# EAGLE schematic RedBot Mechanical Bumper (EAGLE 6.4)
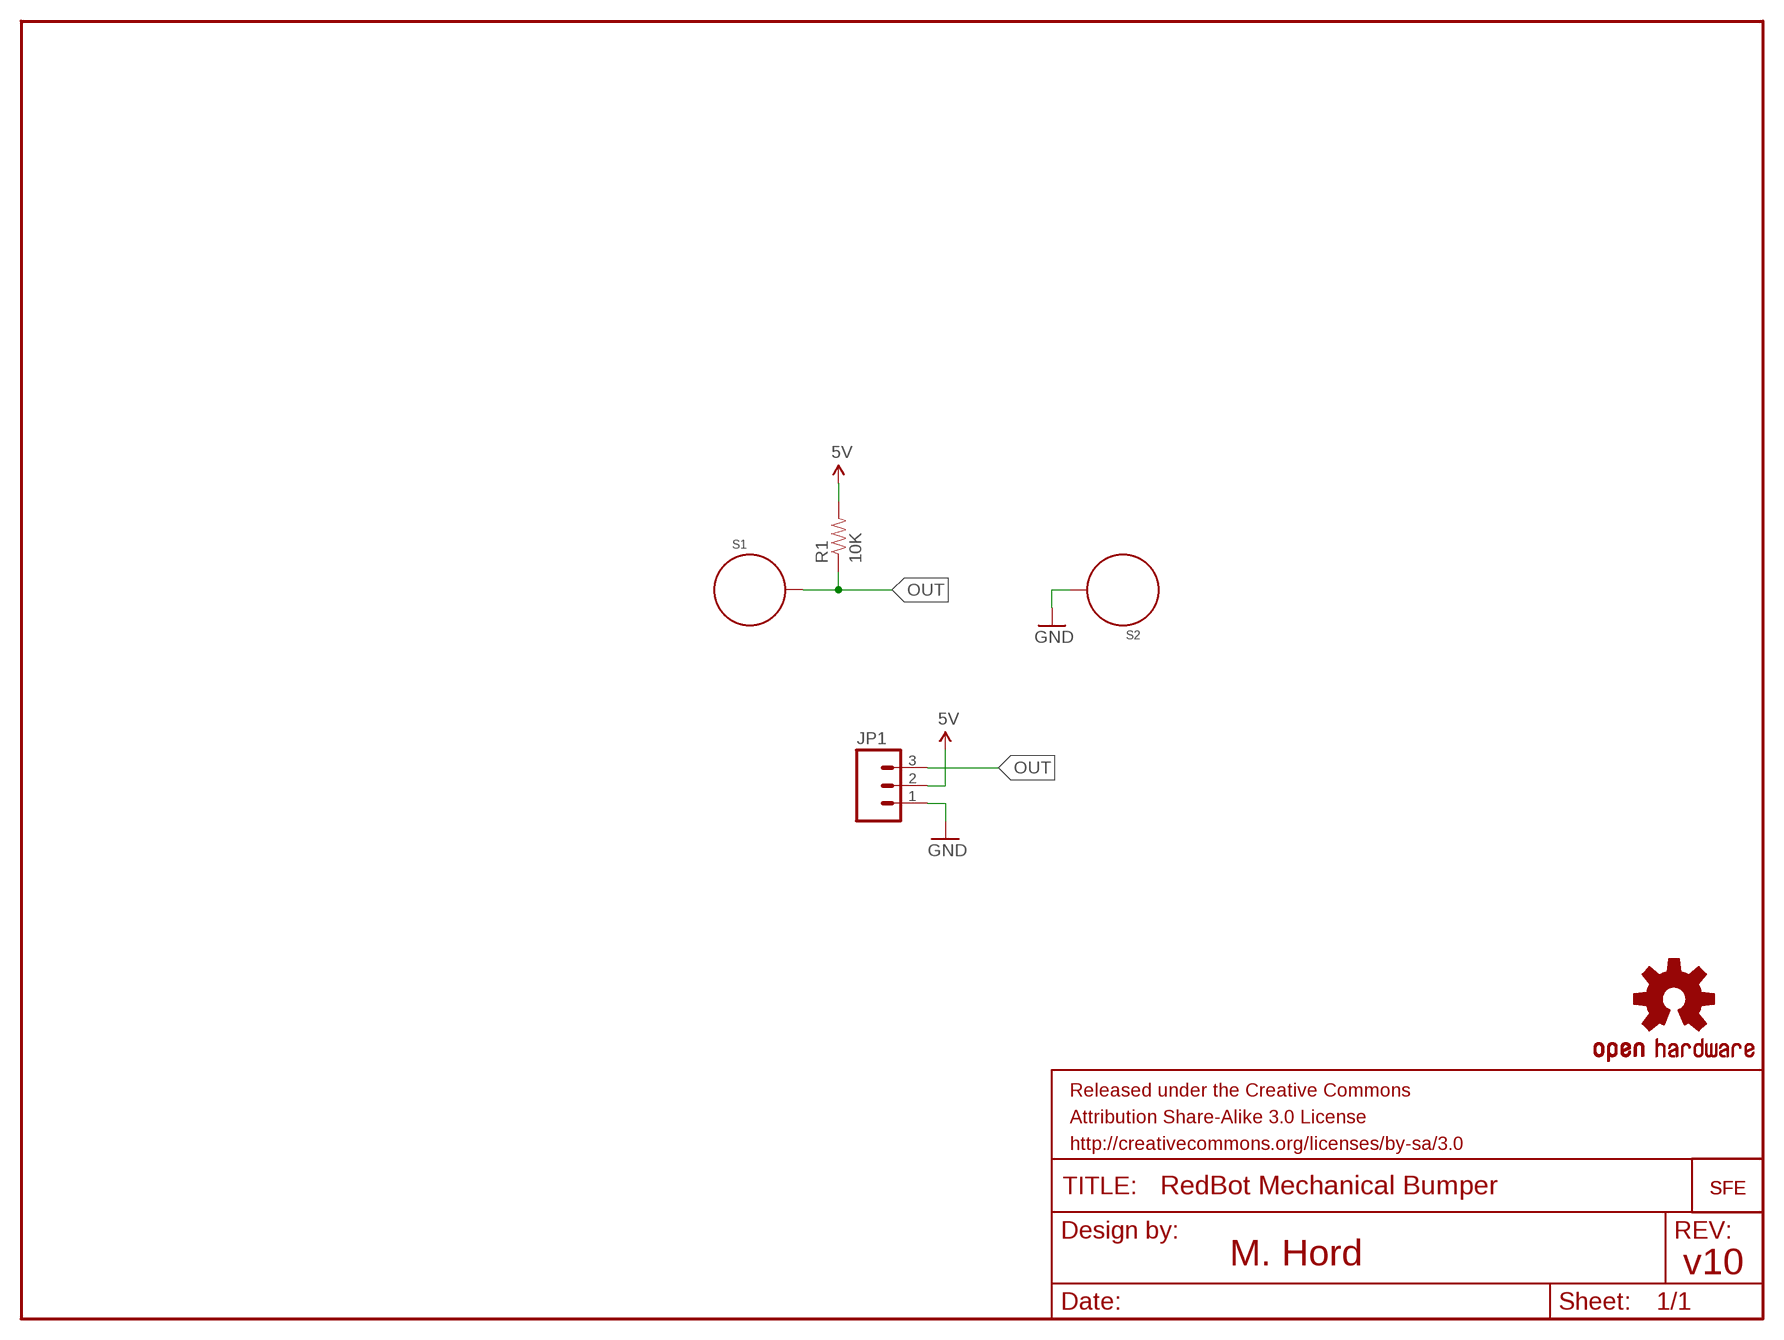
[diagram p0: schematic, sheet 1]

## Parts
FRAME1  FRAME-LETTER  [CREATIVE_COMMONS]
JP1  M03SMD_RA_MALE  [1X03_SMD_RA_MALE]
LOGO1  OSHW-LOGOS  [OSHW-LOGO-S]
LOGO2  LOGO-SFESK  [SFE-LOGO-FLAME]
LOGO3  OSHW-LOGOS  [OSHW-LOGO-S]
LOGO4  LOGO-SFESK  [SFE-LOGO-FLAME]
R1  10K  10KOHM1/10W1%(0603)0603  [0603-RES]
S1  STANDOFF_ELECTRICAL  [STANDOFF-ELECTRICAL]
S2  STANDOFF_ELECTRICAL  [STANDOFF-ELECTRICAL]

## Nets
5V: JP1.2 R1.2
GND: JP1.1 S2.P1
OUT: JP1.3 R1.1 S1.P1

## Notes on the sheet
- M. Hord | v10

## Library data of the parts
FRAME1 = SparkFun-Aesthetics:FRAME-LETTER: Schematic Frame Standard 8.5x11 US Letter frame
JP1 = SparkFun-Connectors:M03: Header 3 Standard 3-pin 0.1" header. Use with straight break away headers (SKU : PRT-00116), right angle break away headers (PRT-00553), swiss pins (PRT-00743), machine pins (PRT-00117), and female headers (PRT-00115). Molex polarized connector foot print use with SKU : PRT-08232 with associated crimp pins and housings.; PROD_ID: CONN-10925
LOGO1 LOGO3 = SparkFun-Aesthetics:OSHW-LOGO: Open Source Hardware Logo This logo indicates the piece of hardware it is found on incorporates a OSHW license and/or adheres to the definition of open source hardware found here: http://freedomdefined.org/OSHW
LOGO2 LOGO4 = SparkFun-Aesthetics:LOGO-SFE: Spark Fun Electronics PCB Logo This is the standard Spark Fun Electronics PCB logo.
R1 = SparkFun-Resistors:10KOHM1/10W1%(0603): RES-00824; PROD_ID: RES-00824
S1 S2 = SparkFun-Electromechanical:STANDOFF_ELECTRICAL: A standoff intended to be an electrically connected point. Pad size and stop size allow for a #4 Phillips pan screw head to make a solid connection to the board.